# EAGLE schematic deployment (EAGLE 9.5.2)
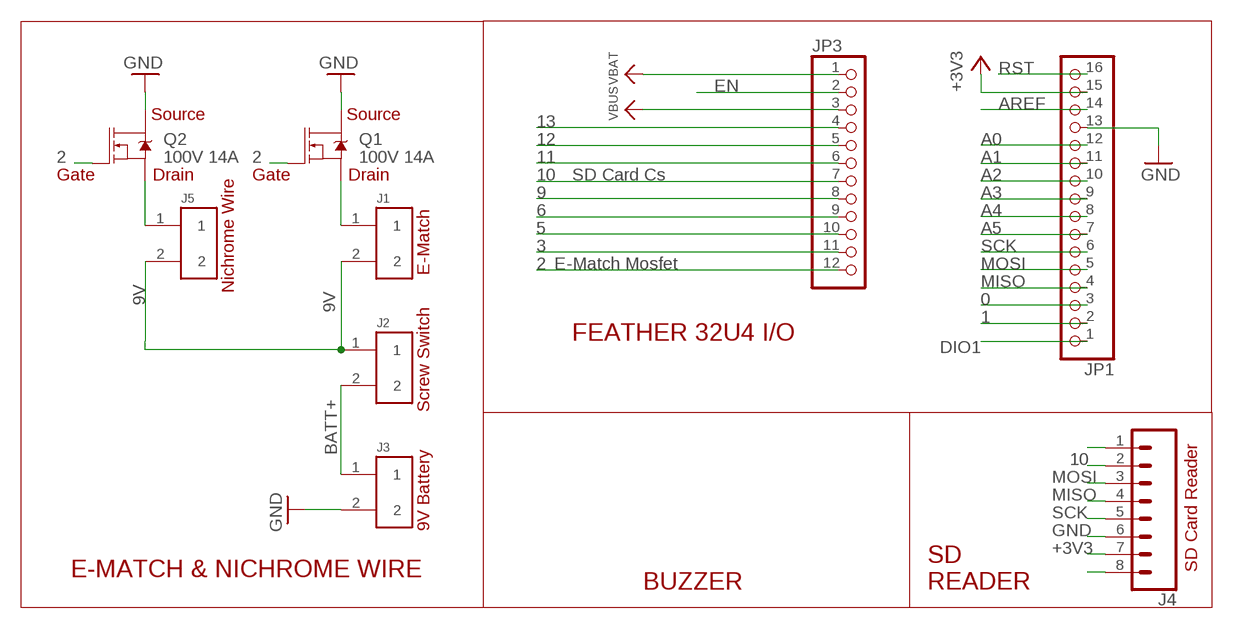
[diagram p0: schematic, sheet 1]

## Parts
J1  1935161  [PHOENIX_1935161]
J2  1935161  [PHOENIX_1935161]
J3  1935161  [PHOENIX_1935161]
J4  CONN_08"  [1X08]
J5  1935161  [PHOENIX_1935161]
JP1  HEADER-1X16ROUND  [1X16_ROUND]
JP3  HEADER-1X12  [1X12_ROUND]
Q1  100V 14A  MOSFET-NCH-FQP30N06L  [TO220V]
Q2  100V 14A  MOSFET-NCH-FQP30N06L  [TO220V]

## Nets
0: JP1.3
1: JP1.2
2: JP3.12 Q1.1(G) Q2.1(G)
3: JP3.11
5: JP3.10
6: JP3.9
9: JP3.8
9V: J1.2 J2.1 J5.2
10: J4.1 J4.2 JP3.7
11: JP3.6
12: JP3.5
13: JP3.4
+3V3: J4.7 JP1.15
A0: JP1.12
A1: JP1.11
A2: JP1.10
A3: JP1.9
A4: JP1.8
A5: JP1.7
AREF: JP1.14
BATT+: J2.2 J3.1
DIO1: JP1.1
EN: JP3.2
GND: J3.2 J4.6 JP1.13 Q1.2(D) Q2.2(D)
MISO: J4.4 JP1.4
MOSI: J4.3 JP1.5
N$1: J1.1 Q1.3(S)
N$2: J5.1 Q2.3(S)
N$9: J4.8
RST: JP1.16
SCK: J4.5 JP1.6
VBAT: JP3.1
VBUS: JP3.3

## Notes on the sheet
- Source | Source
- Gate | Drain | Gate | Drain | SD Card Cs
- E-Match Mosfet
- E-Match
- Nichrome Wire
- FEATHER 32U4 I/O
- Screw Switch
- 9V Battery
- SD Card Reader
- E-MATCH & NICHROME WIRE
- BUZZER
- SD
  READER

## Library data of the parts
J1-J3 J5 = 1935161:1935161: Conn Terminal Blocks 2 POS 5mm Solder ST Thru-Hole 16A; DESCRIPTION: Conn Terminal Blocks 2 POS 5mm Solder ST Thru-Hole 16A; DIGI-KEY_PART_NUMBER: 277-1667-ND; DIGI-KEY_PURCHASE_URL: https://www.digikey.com/product-detail/en/phoenix-contact/1935161/277-1667-ND/568614?utm_source=snapeda&utm_medium=aggregator&utm_campaign=symbol; MF: Phoenix Contact; MP: 1935161; PACKAGE: None
J4 = SparkFun-Connectors:CONN_08: Multi connection point. Often used as Generic Header-pin footprint for 0.1 inch spaced/style header connections On any of the 0.1 inch spaced packages, you can populate with these: Break Away Headers - Straight <https://www.sparkfun.com/products/116> (PRT-00116) Break Away Male Headers - Right Angle <https://www.sparkfun.com/products/553> (PRT-00553) Female Headers <https://www.sparkfun.com/products/115> (PRT-00115) Break Away Headers - Machine Pin <https://www.sparkfun.com/products/117> (PRT-00117) Break Away Female Headers - Swiss Machine Pin <https://www.sparkfun.com/products/743> (PRT-00743) Arduino Stackable Header - 8 Pin <https://www.sparkfun.com/products/9279> (PRT-09279) For SCREWTERMINALS and SPRING TERMINALS visit here: Screw Terimnals on SparkFun.com <https://www.sparkfun.com/search/results?term=Screw+Terminals> (5mm/3.5mm/2.54mm spacing) This device is also useful as a general connection point to wire up your design to another part of your project. Our various solder wires solder well into these plated through hole pads. Hook-Up Wire - Assortment (Stranded, 22 AWG) <https://www.sparkfun.com/products/11375> (PRT-11375) Hook-Up Wire - Assortment (Solid Core, 22 AWG) <https://www.sparkfun.com/products/11367> (PRT-11367) View the entire wire category on our website here <https://www.sparkfun.com/categories/141> Special notes: Molex polarized connector foot print use with SKU : PRT-08231 with associated crimp pins and housings. 1MM SMD Version SKU: PRT-10208 NOTES ON THE VARIANTS LOCK and LOCK_LONGPADS... This footprint was designed to help hold the alignment of a through-hole component (i.e. 6-pin header) while soldering it into place. You may notice that each hole has been shifted either up or down by 0.005 of an inch from it's more standard position (which is a perfectly straight line). This slight alteration caused the pins (the squares in the middle) to touch the edges of the holes. Because they are alternating, it causes a "brace" to hold the component in place. 0.005 has proven to be the perfect amount of "off-center" position when using our standard breakaway headers. Although looks a little odd when you look at the bare footprint, once you have a header in there, the alteration is very hard to notice. Also,if you push a header all the way into place, it is covered up entirely on the bottom side.; PROD_ID: CONN-08438
JP1 = microbuilder:HEADER-1X16: PIN HEADER
JP3 = microbuilder:HEADER-1X12
Q1 Q2 = SparkFun-DiscreteSemi:MOSFET-NCH: N-channel MOSFETs Voltage controlled devices that allow control of high current outputs. SparkFun Products: SparkFun OpenScale <https://www.sparkfun.com/products/13261> SparkFun Digital Sandbox <https://www.sparkfun.com/products/12651> SparkFun Monster Moto Shield <https://www.sparkfun.com/products/10182> SparkFun MOSFET Power Controller <https://www.sparkfun.com/products/11214>; PROD_ID: TRANS-10060; VALUE: 60V/32A/35mΩ